# EAGLE schematic BATT_CPU (EAGLE 9.6.2)
COMPANY: ADAFRUIT INDUSTRIES; DRAWN: KTOWN; REV: B
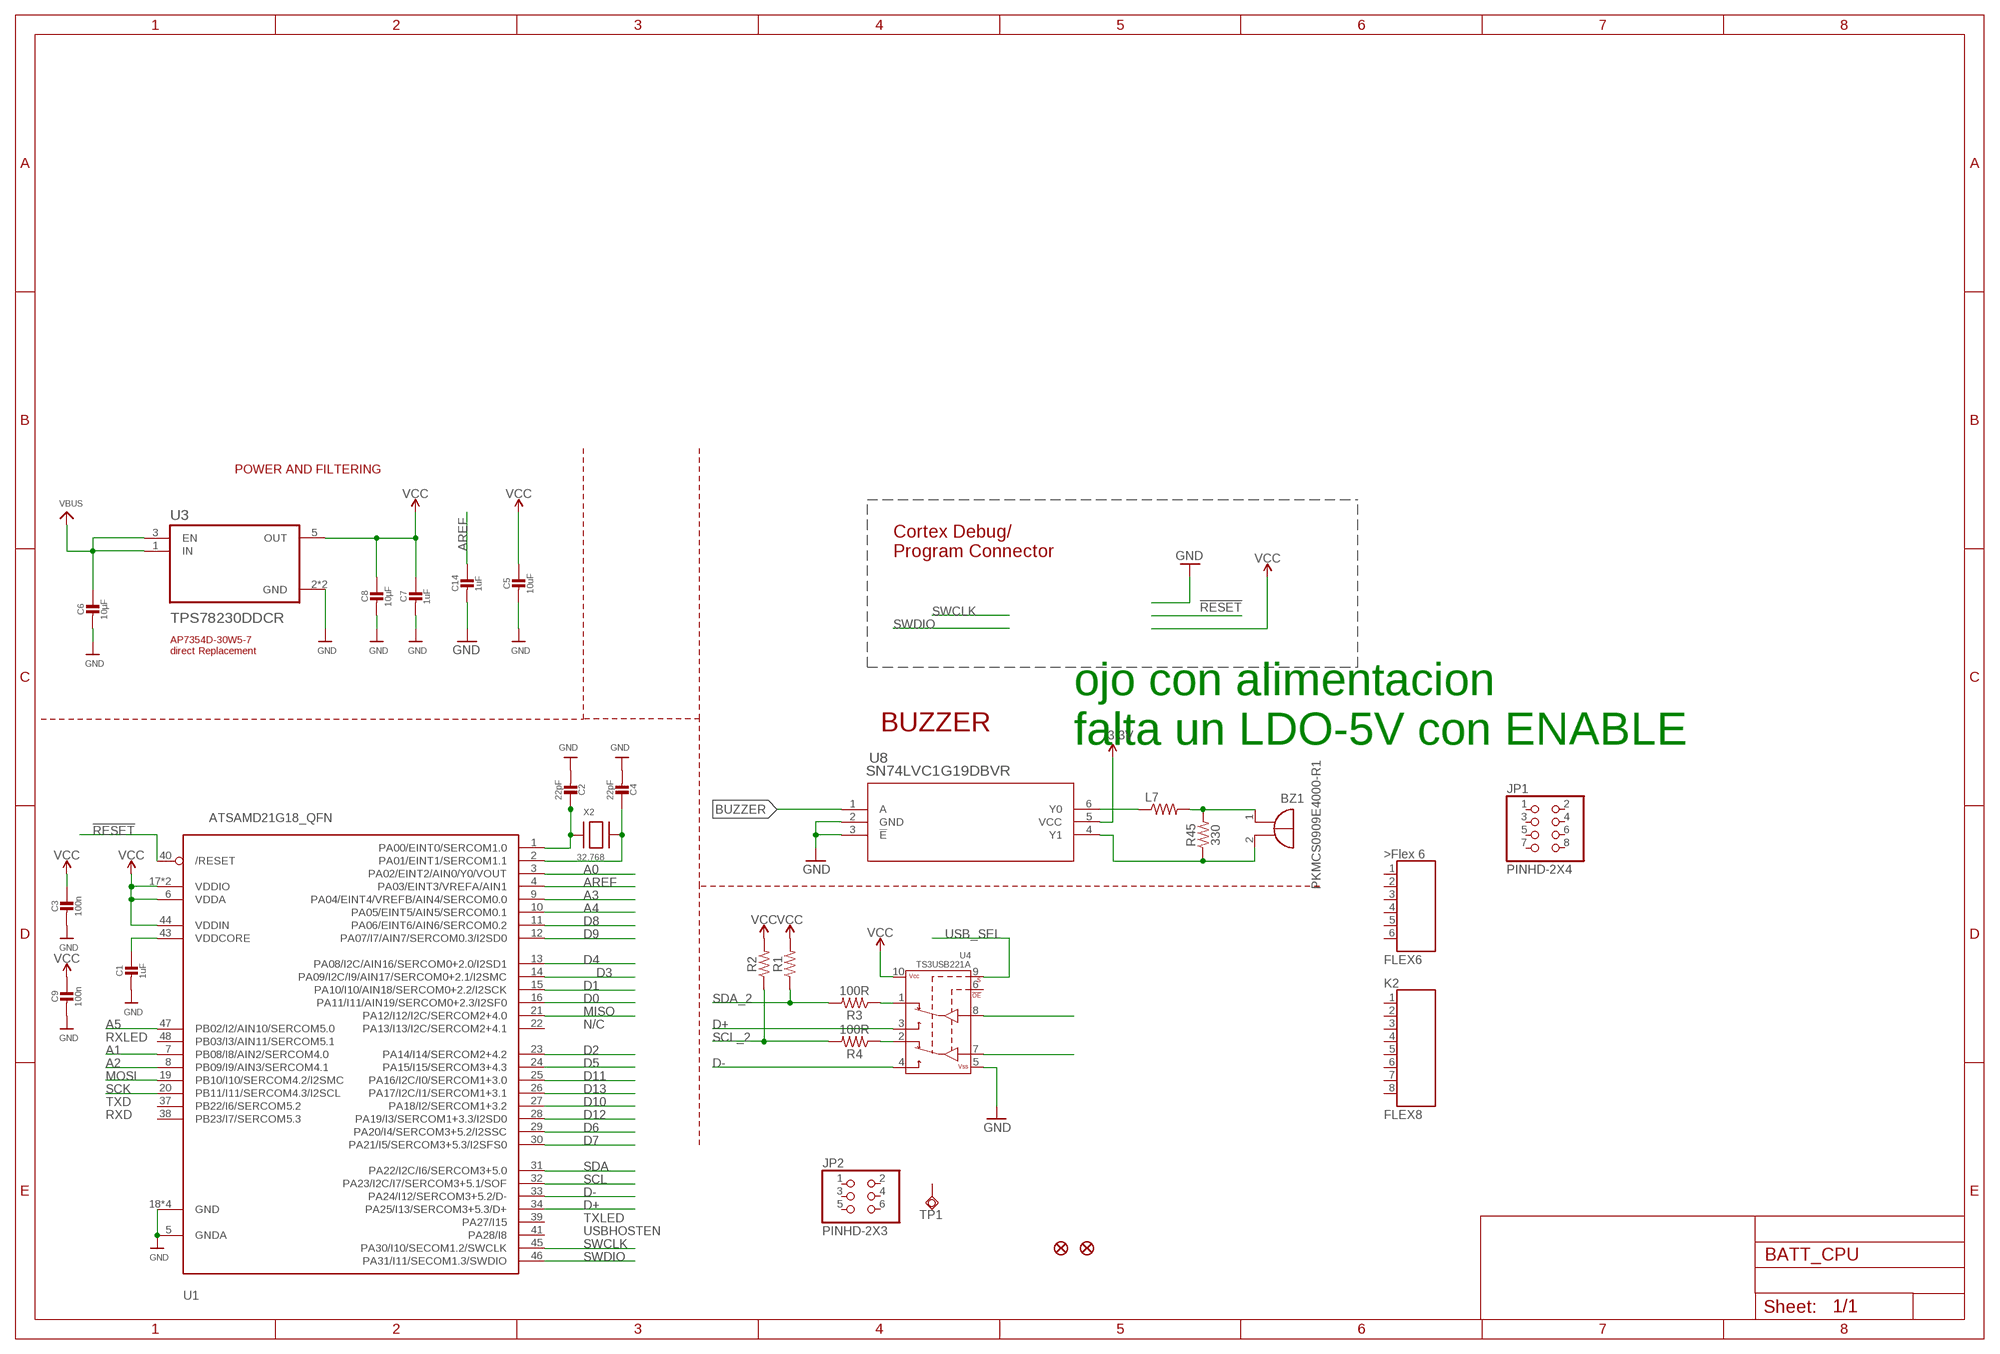
[diagram p0: schematic, sheet 1]

## Parts
BZ1  PKMCS0909E4000-R1  [PKMCS0909]
C1  1uF  CAP_CERAMIC0603_NO  [0603-NO]
C2  22pF  CAP_CERAMIC0603_NO  [0603-NO]
C3  100n  CAP_CERAMIC0603_NO  [0603-NO]
C4  22pF  CAP_CERAMIC0603_NO  [0603-NO]
C5  10uF  CAP_CERAMIC0805-NOOUTLINE  [0805-NO]
C6  10µF  CAP_CERAMIC0805-NOOUTLINE  [0805-NO]
C7  1uF  CAP_CERAMIC0603_NO  [0603-NO]
C8  10µF  CAP_CERAMIC0805-NOOUTLINE  [0805-NO]
C9  100n  CAP_CERAMIC0603_NO  [0603-NO]
C14  1uF  CAP_CERAMIC0603_NO  [0603-NO]
JP1  PINHD-2X4  [2X04]
JP2  PINHD-2X3  [2X03]
K1  FLEX6  [FLEX6]
K2  FLEX8  [FLEX8]
L7  MMZ2012Y202BT000  RESISTOR0805-RES  [0805]
R1  RESISTOR0603  [0603]
R2  RESISTOR0603  [0603]
R3  100R  RESISTOR0603  [0603]
R4  100R  RESISTOR0603  [0603]
R45  330  RESISTOR0805  [0805]
TP1  TESTPAD_TPSQB1,27  [TESTPAD_B1,27]
U1  ATSAMD21G18_QFN  ATSAMD21J_QFN  [TQFN48_7MM]
U3  TPS78230DDCR  [SOT95P280X110-5N]
U4  TS3USB221A  [QFN-10-RSE]
U8  SN74LVC1G19DBVR  [DBV6]
U$34  FIDUCIAL""  [FIDUCIAL_1MM]
U$35  FIDUCIAL""  [FIDUCIAL_1MM]
X2  32.768  XTAL-3.2X1.5  [XTAL3215]

## Nets
3.3V: U8.5(VCC)
!RESET: U1.40(/RESET)
A0: U1.3(PA02/EINT2/AIN0/Y0/VOUT)
A1: U1.7(PB08/I8/AIN2/SERCOM4.0)
A2: U1.8(PB09/I9/AIN3/SERCOM4.1)
A3: U1.9(PA04/EINT4/VREFB/AIN4/SERCOM0.0)
A4: U1.10(PA05/EINT5/AIN5/SERCOM0.1)
A5: U1.47(PB02/I2/AIN10/SERCOM5.0)
AREF: C14.1 U1.4(PA03/EINT3/VREFA/AIN1)
BUZZER: U8.1(A)
D0: U1.16(PA11/I11/AIN19/SERCOM0+2.3/I2SF0)
D1: U1.15(PA10/I10/AIN18/SERCOM0+2.2/I2SCK)
D2: U1.23(PA14/I14/SERCOM2+4.2)
D3: U1.14(PA09/I2C/I9/AIN17/SERCOM0+2.1/I2SMC)
D4: U1.13(PA08/I2C/AIN16/SERCOM0+2.0/I2SD1)
D5: U1.24(PA15/I15/SERCOM3+4.3)
D6: U1.29(PA20/I4/SERCOM3+5.2/I2SSC)
D7: U1.30(PA21/I5/SERCOM3+5.3/I2SFS0)
D8: U1.11(PA06/EINT6/AIN6/SERCOM0.2)
D9: U1.12(PA07/I7/AIN7/SERCOM0.3/I2SD0)
D10: U1.27(PA18/I2/SERCOM1+3.2)
D11: U1.25(PA16/I2C/I0/SERCOM1+3.0)
D12: U1.28(PA19/I3/SERCOM1+3.3/I2SD0)
D13: U1.26(PA17/I2C/I1/SERCOM1+3.1)
D+: U1.34(PA25/I13/SERCOM3+5.3/D+) U4.3(2D+)
D-: U1.33(PA24/I12/SERCOM3+5.2/D-) U4.4(2D-)
GND: C1.2 C2.2 C3.2 C4.2 C5.2 C6.2 C7.2 C8.2 C9.2 C14.2 U1.5(GNDA) U1.18(GND) U1.35(GND) U1.42(GND) U1.THERMAL(GND) U3.2(GND) U3.4(GND) U4.5(VSS) U8.2(GND) U8.3(!E)
MISO: U1.21(PA12/I12/I2C/SERCOM2+4.0)
MOSI: U1.19(PB10/I10/SERCOM4.2/I2SMC)
N$2: R3.1 U4.1(1D+)
N$3: R4.1 U4.2(1D-)
N$4: U4.8(D+)
N$5: C2.1 U1.1(PA00/EINT0/SERCOM1.0) X2.P$1
N$6: U4.7(D-)
N$7: C4.1 U1.2(PA01/EINT1/SERCOM1.1) X2.P$2
N$17: L7.1 U8.6(Y0)
N$19: BZ1.1(+) L7.2 R45.2
N$22: BZ1.2(-) R45.1 U8.4(Y1)
SCK: U1.20(PB11/I11/SERCOM4.3/I2SCL)
SCL: U1.32(PA23/I2C/I7/SERCOM3+5.1/SOF)
SCL_2: R2.1 R4.2
SDA: U1.31(PA22/I2C/I6/SERCOM3+5.0)
SDA_2: R1.1 R3.2
SWCLK: U1.45(PA30/I10/SECOM1.2/SWCLK)
SWDIO: U1.46(PA31/I11/SECOM1.3/SWDIO)
USB_SEL: U4.9(S)
VBUS: C6.1 U3.1(IN) U3.3(EN)
VCC: C3.1 C5.1 C7.1 C8.1 C9.1 R1.2 R2.2 U1.6(VDDA) U1.17(VDDIO) U1.36(VDDIO) U1.44(VDDIN) U3.5(OUT) U4.10(VCC)
VDDCORE: C1.1 U1.43(VDDCORE)
Unconnected: JP1.1 JP1.2 JP1.3 JP1.4 JP1.5 JP1.6 JP1.7 JP1.8 JP2.1 JP2.2 JP2.3 JP2.4 JP2.5 JP2.6 K1.1 K1.2 K1.3 K1.4 K1.5 K1.6 K2.1 K2.2 K2.3 K2.4 K2.5 K2.6 K2.7 K2.8 TP1.TP U1.22(PA13/I13/I2C/SERCOM2+4.1) U1.37(PB22/I6/SERCOM5.2) U1.38(PB23/I7/SERCOM5.3) U1.39(PA27/I15) U1.41(PA28/I8) U1.48(PB03/I3/AIN11/SERCOM5.1) U4.6(!OE)

## Notes on the sheet
- POWER AND FILTERING
- Cortex Debug/
  Program Connector
- AP7354D-30W5-7 
  direct Replacement
- BUZZER
- ojo con alimentacion
  falta un LDO-5V con ENABLE
- N/C
- RXLED
- TXD
- RXD
- TXLED
- USBHOSTEN

## Library data of the parts
BZ1 = buzzer:PKMCS0909E4000-R1: PKMCS0909E4000-R1 Source : http://www.murata.com/~/media/webrenewal/products/sound/sounder/vppt-buzj083-d.ashx
C1-C9 C14 = microbuilder:CAP_CERAMIC: Ceramic Capacitors For new designs, use the packages preceded by an '_' character since they are more reliable: The following footprints should be used on most boards: _0402 - Standard footprint for regular board layouts _0603 - Standard footprint for regular board layouts _0805 - Standard footprint for regular board layouts _1206 - Standard footprint for regular board layouts For extremely tight-pitch boards where space is at a premium, the following 'micro-pitch' footprints can be used (smaller pads, no silkscreen outline, etc.): _0402MP - Micro-pitch footprint for very dense/compact boards _0603MP - Micro-pitch footprint for very dense/compact boards _0805MP - Micro-pitch footprint for very dense/compact boards _1206MP - Micro-pitch footprint for very dense/compact boards
JP1 = Connector:PINHD-2X4: PIN HEADER; CATEGORY: CONNECTOR; SUB-CATEGORY: PIN-HEADER
JP2 = Connector:PINHD-2X3: PIN HEADER; CATEGORY: CONNECTOR; SUB-CATEGORY: PIN-HEADER
K1 = Flex_Faja_connector:FLEX6: WR-FPC 1mm SMT Horiz. Bot. Contact Hinge type WR-FPC 1mm 06 pins Hinge type SMT Horizontal Bottom Contact ;=>Code : Con_FPC_ZIF_1.00_6861xx148922_686106148922 <http://katalog.we-online.de/media/images/eican/Con_FPC_ZIF_1.00_686110148922_pf2.jpg> Details see: http://katalog.we-online.de/em/datasheet/6861xx148922.pdf Created 2014-10-08, Karrer Zheng 2014 (C) Wurth Elektronik
K2 = Flex_Faja_connector:FLEX8: WR-FPC 1mm SMT Horiz. Bot. Contact Hinge type WR-FPC 1mm 08 pins Hinge type SMT Horizontal Bottom Contact ;=>Code : Con_FPC_ZIF_1.00_6861xx148922_686108148922 <http://katalog.we-online.de/media/images/eican/Con_FPC_ZIF_1.00_686110148922_pf2.jpg> Details see: http://katalog.we-online.de/em/datasheet/6861xx148922.pdf Created 2014-10-08, Karrer Zheng 2014 (C) Wurth Elektronik
L7 = SparkFun:RESISTOR: Resistor Basic schematic elements and footprints for 0603, 1206, and PTH resistors.
R1-R4 R45 = SparkFun-Resistors:RESISTOR: Generic Resistor Package
TP1 = BeagleBone_Blue_R3:TESTPAD_TPSQ: Test pad
U1 = microbuilder:ATSAMD21J
U3 = TPS78230DDCR:TPS78230DDCR: Check prices <https://pricing.snapeda.com/parts/TPS78230DDCR/Texas%20Instruments/view-part?ref=eda>; AVAILABILITY: Good; DESCRIPTION: 150-mA, nano-IQ, low-dropout voltage regulator with enable from -40C to +125C 5-SOT-23-THIN -40 to 125; MF: Texas Instruments; MP: TPS78230DDCR; PACKAGE: SOT-23-THN-5 Texas Instruments; PRICE: None; PURCHASE-URL: https://pricing.snapeda.com/search/part/TPS78230DDCR/?ref=eda
U4 = SparkFun-IC-Special-Function:TS3USB221A: DPDT Analog Mux DPDT Analog Mux Vcc 2.5 to 3.3V Passes up to 5.5V at 3.3V supply 900MHz BW, 6Ω switch resistance SparkFun Products SparkFun FTDI SmartBasic <https://www.sparkfun.com/products/12935> (DEV-12935); PROD_ID: IC-12115
U8 = SN74LVC1G19DBVR:SN74LVC1G19DBVR; DATASHEET_URL: http://www.ti.com/lit/gpn/SN74LVC1G19; DESCRIPTION: 1-of-2 Decoder/Demultiplexer; FAMILY_NAME: LL Decoder, Mux/Demux; GENERIC_PART_NUMBER: SN74LVC1G19; INDUSTRY_STD_PKG_TYPE: SOT-23; MANUFACTURER: Texas Instruments; MANUFACTURER_PART_NUMBER: SN74LVC1G19DBVR; PACKAGE_DESIGNATOR: DBV; PIN_COUNT: 6; VENDOR: Texas Instruments
U$34 U$35 = microbuilder:FIDUCIAL: Fiducial Alignment Points Various fiducial points for machine vision alignment.; BOM: EXCLUDE
X2 = adafruit2:XTAL: Low cost SMT crystals, no capacitors included http://www.ladyada.net/library/eagle

## Net classes
2 gnd: width 0.305 mm, drill 0.483 mm, clearance 0.203 mm